# Altium schematic sheet LED-PCB_Master.SchDoc
size B; SheetNumber: 1; SheetTotal: 5
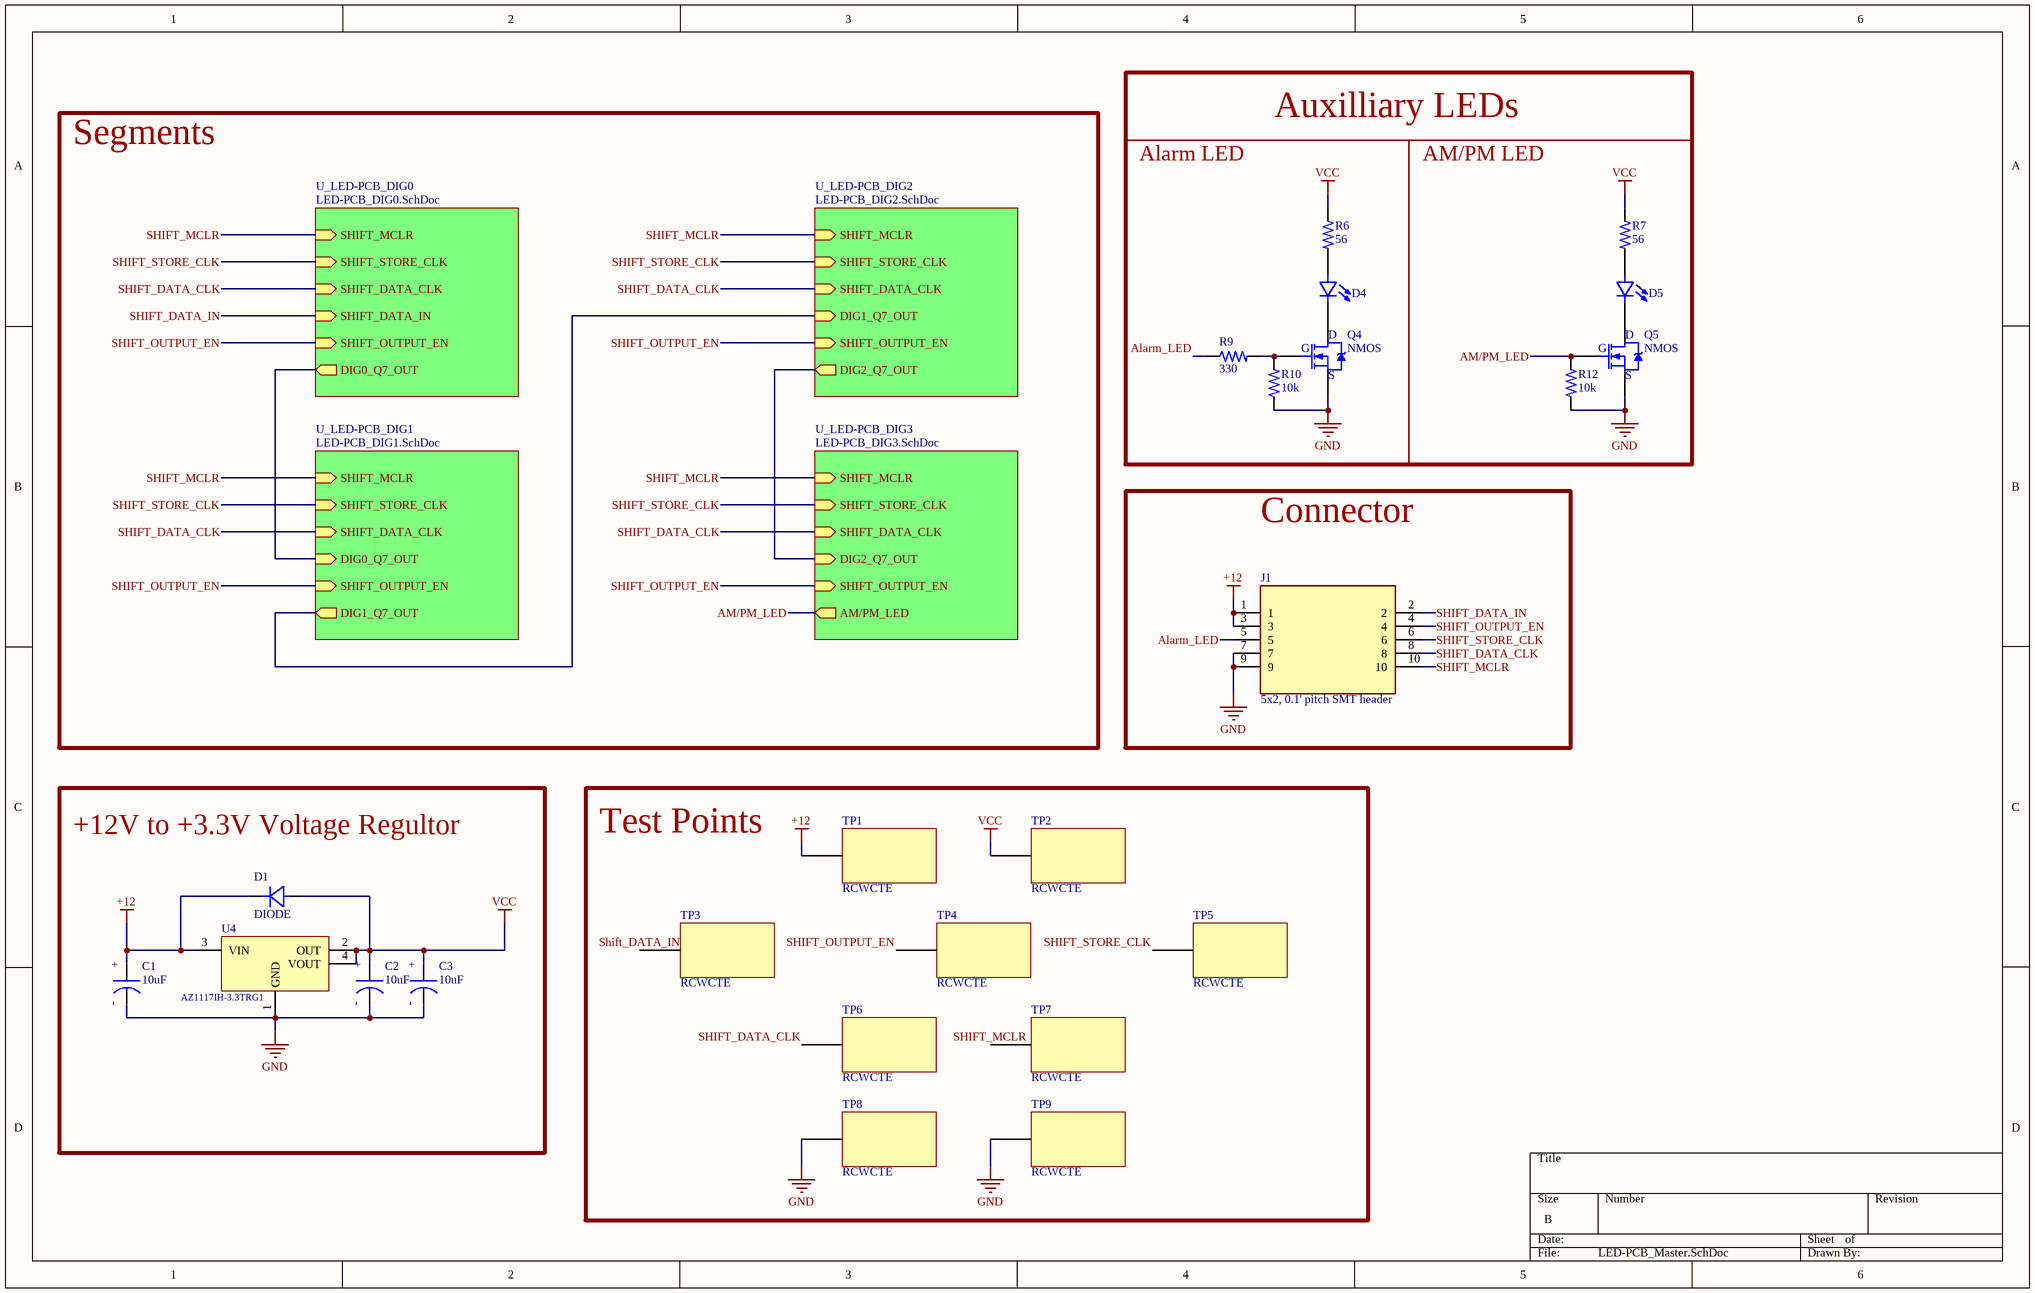
[diagram p0: LED-PCB_Master.SchDoc]

## Parts
C1  value 10uF  [CAP_CAN_POLY]  (hidden comment: CAP)
C2  value 10uF  [CAP_CAN_POLY]  (hidden comment: CAP)
C3  value 10uF  [CAP_CAN_POLY]  (hidden comment: CAP)
D1  DIODE  [DO-214AC]
D4  LED - single  [LED - 1204 RA]  (value not drawn)
D5  LED - single  [LED - 1204 RA]  (value not drawn)
J1  5x2, 0.1' pitch SMT header  [5x2, 0.1' pitch SMT header]
Q4  NMOS  [SOT-23]
Q5  NMOS  [SOT-23]
R6  value 56  [0402 RES]  (hidden comment: RES)
R7  value 56  [0402 RES]  (hidden comment: RES)
R9  value 330  [0402R]  (hidden comment: RES)
R10  value 10k  [0402R]  (hidden comment: RES)
R12  value 10k  [0402R]  (hidden comment: RES)
TP1  RCWCTE  [RCWCTE]
TP2  RCWCTE  [RCWCTE]
TP3  RCWCTE  [RCWCTE]
TP4  RCWCTE  [RCWCTE]
TP5  RCWCTE  [RCWCTE]
TP6  RCWCTE  [RCWCTE]
TP7  RCWCTE  [RCWCTE]
TP8  RCWCTE  [RCWCTE]
TP9  RCWCTE  [RCWCTE]
U4  AZ1117IH-3.3TRG1  [SOT-223-3]

## Blocks framed on the sheet
Auxilliary LEDs: D4 Q4 R6 R9 R10
AM/PM LED: D5 Q5 R7 R12
Connector: J1
+12V to +3.3V Voltage Regultor: C1-C3 D1 U4
Test Points: TP1-TP9

## Sub-sheets
U_LED-PCB_DIG0 = LED-PCB_DIG0.SchDoc: SHIFT_MCLR (in), SHIFT_STORE_CLK (in), SHIFT_DATA_CLK (in), SHIFT_DATA_IN (in), SHIFT_OUTPUT_EN (in), DIG0_Q7_OUT (out)
U_LED-PCB_DIG1 = LED-PCB_DIG1.SchDoc: SHIFT_MCLR (in), SHIFT_STORE_CLK (in), SHIFT_DATA_CLK (in), DIG0_Q7_OUT (in), SHIFT_OUTPUT_EN (in), DIG1_Q7_OUT (out)
U_LED-PCB_DIG2 = LED-PCB_DIG2.SchDoc: SHIFT_MCLR (in), SHIFT_STORE_CLK (in), SHIFT_DATA_CLK (in), DIG1_Q7_OUT (in), SHIFT_OUTPUT_EN (in), DIG2_Q7_OUT (out)
U_LED-PCB_DIG3 = LED-PCB_DIG3.SchDoc: SHIFT_MCLR (in), SHIFT_STORE_CLK (in), SHIFT_DATA_CLK (in), DIG2_Q7_OUT (in), SHIFT_OUTPUT_EN (in), AM/PM_LED (out)

## Nets
+12: C1.1 D1.K J1.1 J1.3 TP1.1 U4.3(VIN)
GND: C1.2 C2.2 C3.2 J1.7 J1.9 Q4.2(S) Q5.2(S) R10.1 R12.1 TP8.1 TP9.1 U4.1(GND)
VCC: C2.1 C3.1 D1.A R6.1 R7.1 TP2.1 U4.2(OUT) U4.4(VOUT)
Alarm_LED: J1.5 R9.1
AM/PM_LED: Q5.1(G) R12.2 ; sheet U_LED-PCB_DIG3/AM/PM_LED
SHIFT_DATA_CLK: J1.8 TP6.1 ; sheet U_LED-PCB_DIG0/SHIFT_DATA_CLK, sheet U_LED-PCB_DIG1/SHIFT_DATA_CLK, sheet U_LED-PCB_DIG2/SHIFT_DATA_CLK, sheet U_LED-PCB_DIG3/SHIFT_DATA_CLK
SHIFT_DATA_IN: J1.2 TP3.1 ; sheet U_LED-PCB_DIG0/SHIFT_DATA_IN
SHIFT_MCLR: J1.10 TP7.1 ; sheet U_LED-PCB_DIG0/SHIFT_MCLR, sheet U_LED-PCB_DIG1/SHIFT_MCLR, sheet U_LED-PCB_DIG2/SHIFT_MCLR, sheet U_LED-PCB_DIG3/SHIFT_MCLR
SHIFT_OUTPUT_EN: J1.4 TP4.1 ; sheet U_LED-PCB_DIG0/SHIFT_OUTPUT_EN, sheet U_LED-PCB_DIG1/SHIFT_OUTPUT_EN, sheet U_LED-PCB_DIG2/SHIFT_OUTPUT_EN, sheet U_LED-PCB_DIG3/SHIFT_OUTPUT_EN
SHIFT_STORE_CLK: J1.6 TP5.1 ; sheet U_LED-PCB_DIG0/SHIFT_STORE_CLK, sheet U_LED-PCB_DIG1/SHIFT_STORE_CLK, sheet U_LED-PCB_DIG2/SHIFT_STORE_CLK, sheet U_LED-PCB_DIG3/SHIFT_STORE_CLK
NetD4_1: D4.1(A) R6.2
NetD4_2: D4.2(C) Q4.3(D)
NetD5_1: D5.1(A) R7.2
NetD5_2: D5.2(C) Q5.3(D)
NetQ4_1: Q4.1(G) R9.2 R10.2
(unnamed): sheet U_LED-PCB_DIG0/DIG0_Q7_OUT, sheet U_LED-PCB_DIG1/DIG0_Q7_OUT
(unnamed): sheet U_LED-PCB_DIG1/DIG1_Q7_OUT, sheet U_LED-PCB_DIG2/DIG1_Q7_OUT
(unnamed): sheet U_LED-PCB_DIG2/DIG2_Q7_OUT, sheet U_LED-PCB_DIG3/DIG2_Q7_OUT

## Notes on the sheet
- Segments
- Alarm LED
- (in symbol CAP - POLARIZED) +; -

## Library data of the parts
C1-C3 = CAP - POLARIZED: Capacitor; MFR: Würth Elektronik; MFR PN: 865080642006; Type: SMD; Vendor: *; Vendor PN: *; Vendor Link: *; ClassName: DirectConnect
D1 = DIODE: DIODE GEN PURP; MFR: Micro Commercial Co; MFR PN: GS1M-LTP; Type: SMD; Value: *; ClassName: DirectConnect
D4 D5 = LED - single: LED; MFR: Würth Elektronik; MFR PN: 155124RS73200; Color: Red; Type: SMD; Notes: Right-Angle Sideways Mount; Vendor: *; Vendor PN: *; Vendor Link: *
J1 = 5x2, 0.1' pitch SMT header: CONN HEADER SMD 10POS 2.54MM; MFR PN: 3020-10-0300-00; MFR: CNC Tech; ClassName: DirectConnect
Q4 Q5 = NMOS: N-Channel MOSFET; MFR PN: DMN63D8L-7; MFR: Diodes Incorporated
R6 R7 = RES: Resistor; MFR PN: RC0402FR-0756RL; MFR: YAGEO
R9 = RES: Resistor; MFR PN: RC0402JR-13330RL; MFR: YAGEO; Vendor: *; Vendor PN: *; Vendor Link: *
R10 R12 = RES: Resistor; MFR PN: RC0402JR-0710KL; MFR: YAGEO; Vendor: *; Vendor PN: *; Vendor Link: *
TP1-TP9 = Test Point: MFR: KOA Speer Electronics, Inc.; Value: DNS; MFR PN: RCWCTE
U4 = AZ1117IH-3.3TRG1: IC REG LINEAR 3.3V 1A SOT223; MFR: Diodes Incorporated; MFR PN: AZ1117IH-3.3TRG1; ClassName: DirectConnect